# Altium schematic sheet TinyShuffle v.0b.SchDoc
size A2
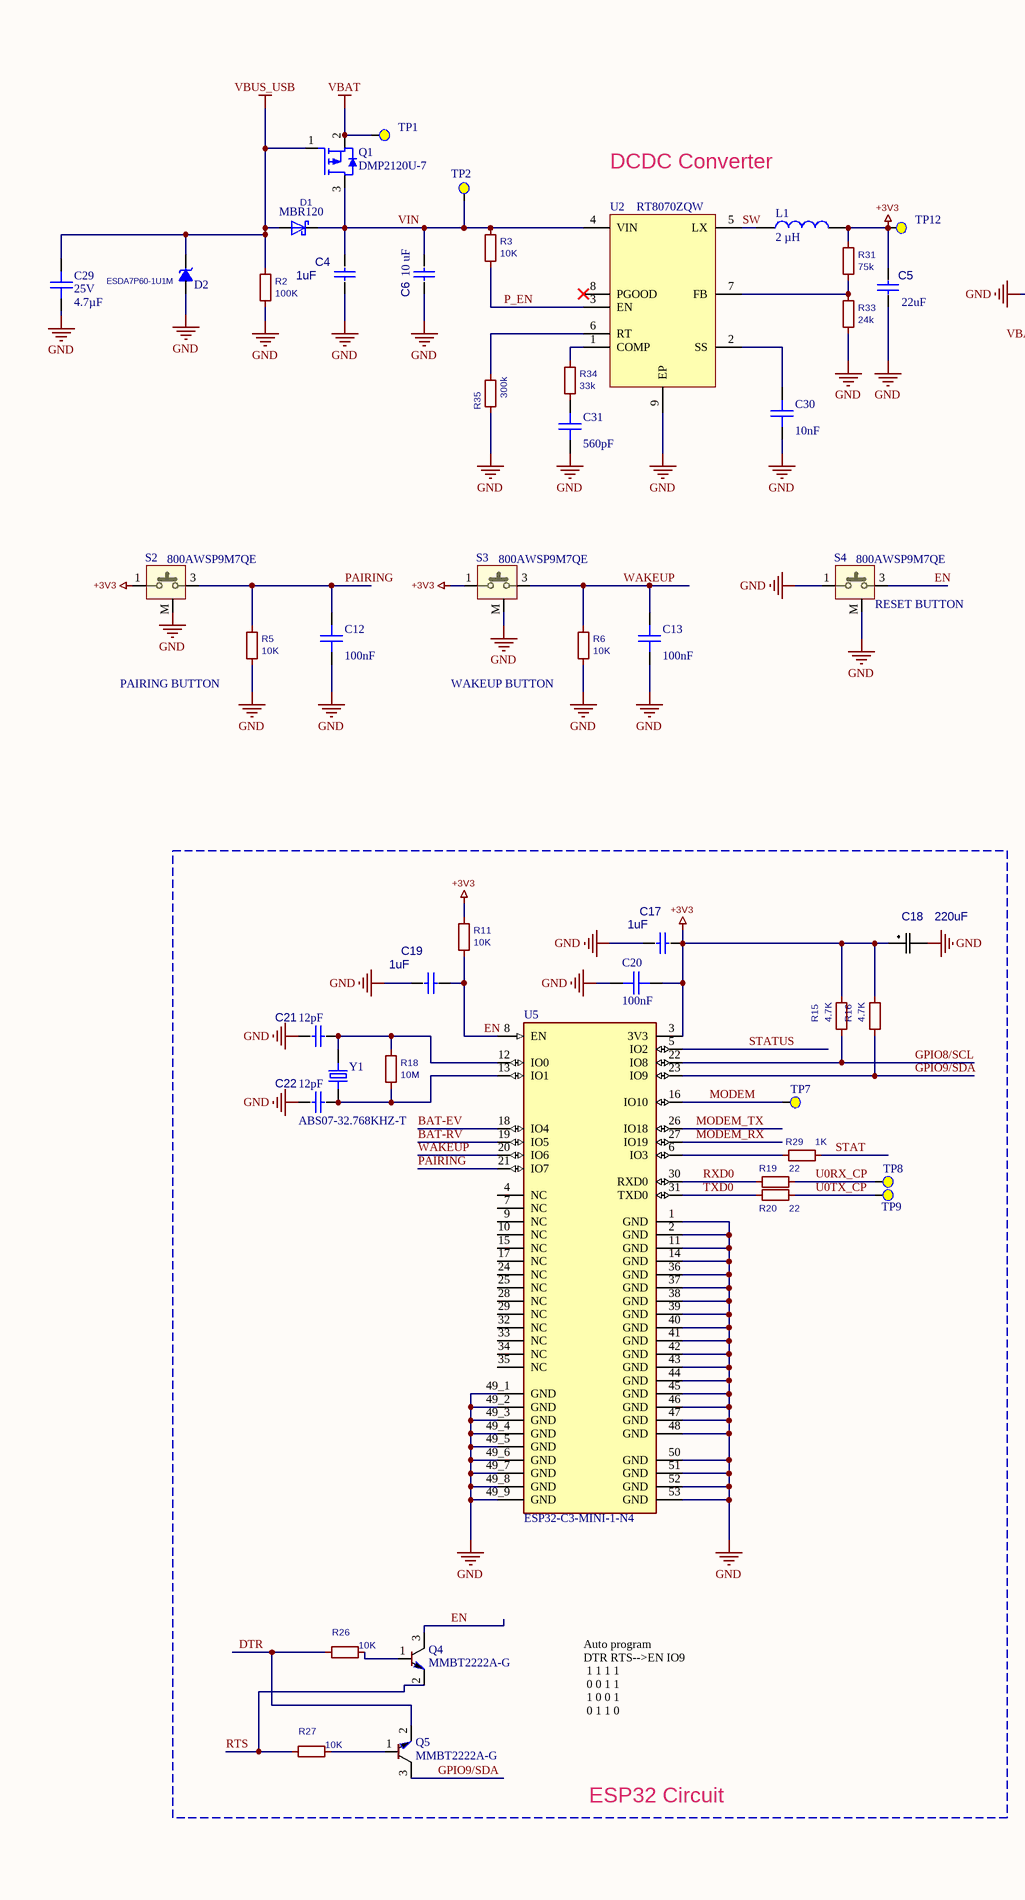
[diagram p0: TinyShuffle v.0b.SchDoc, left]
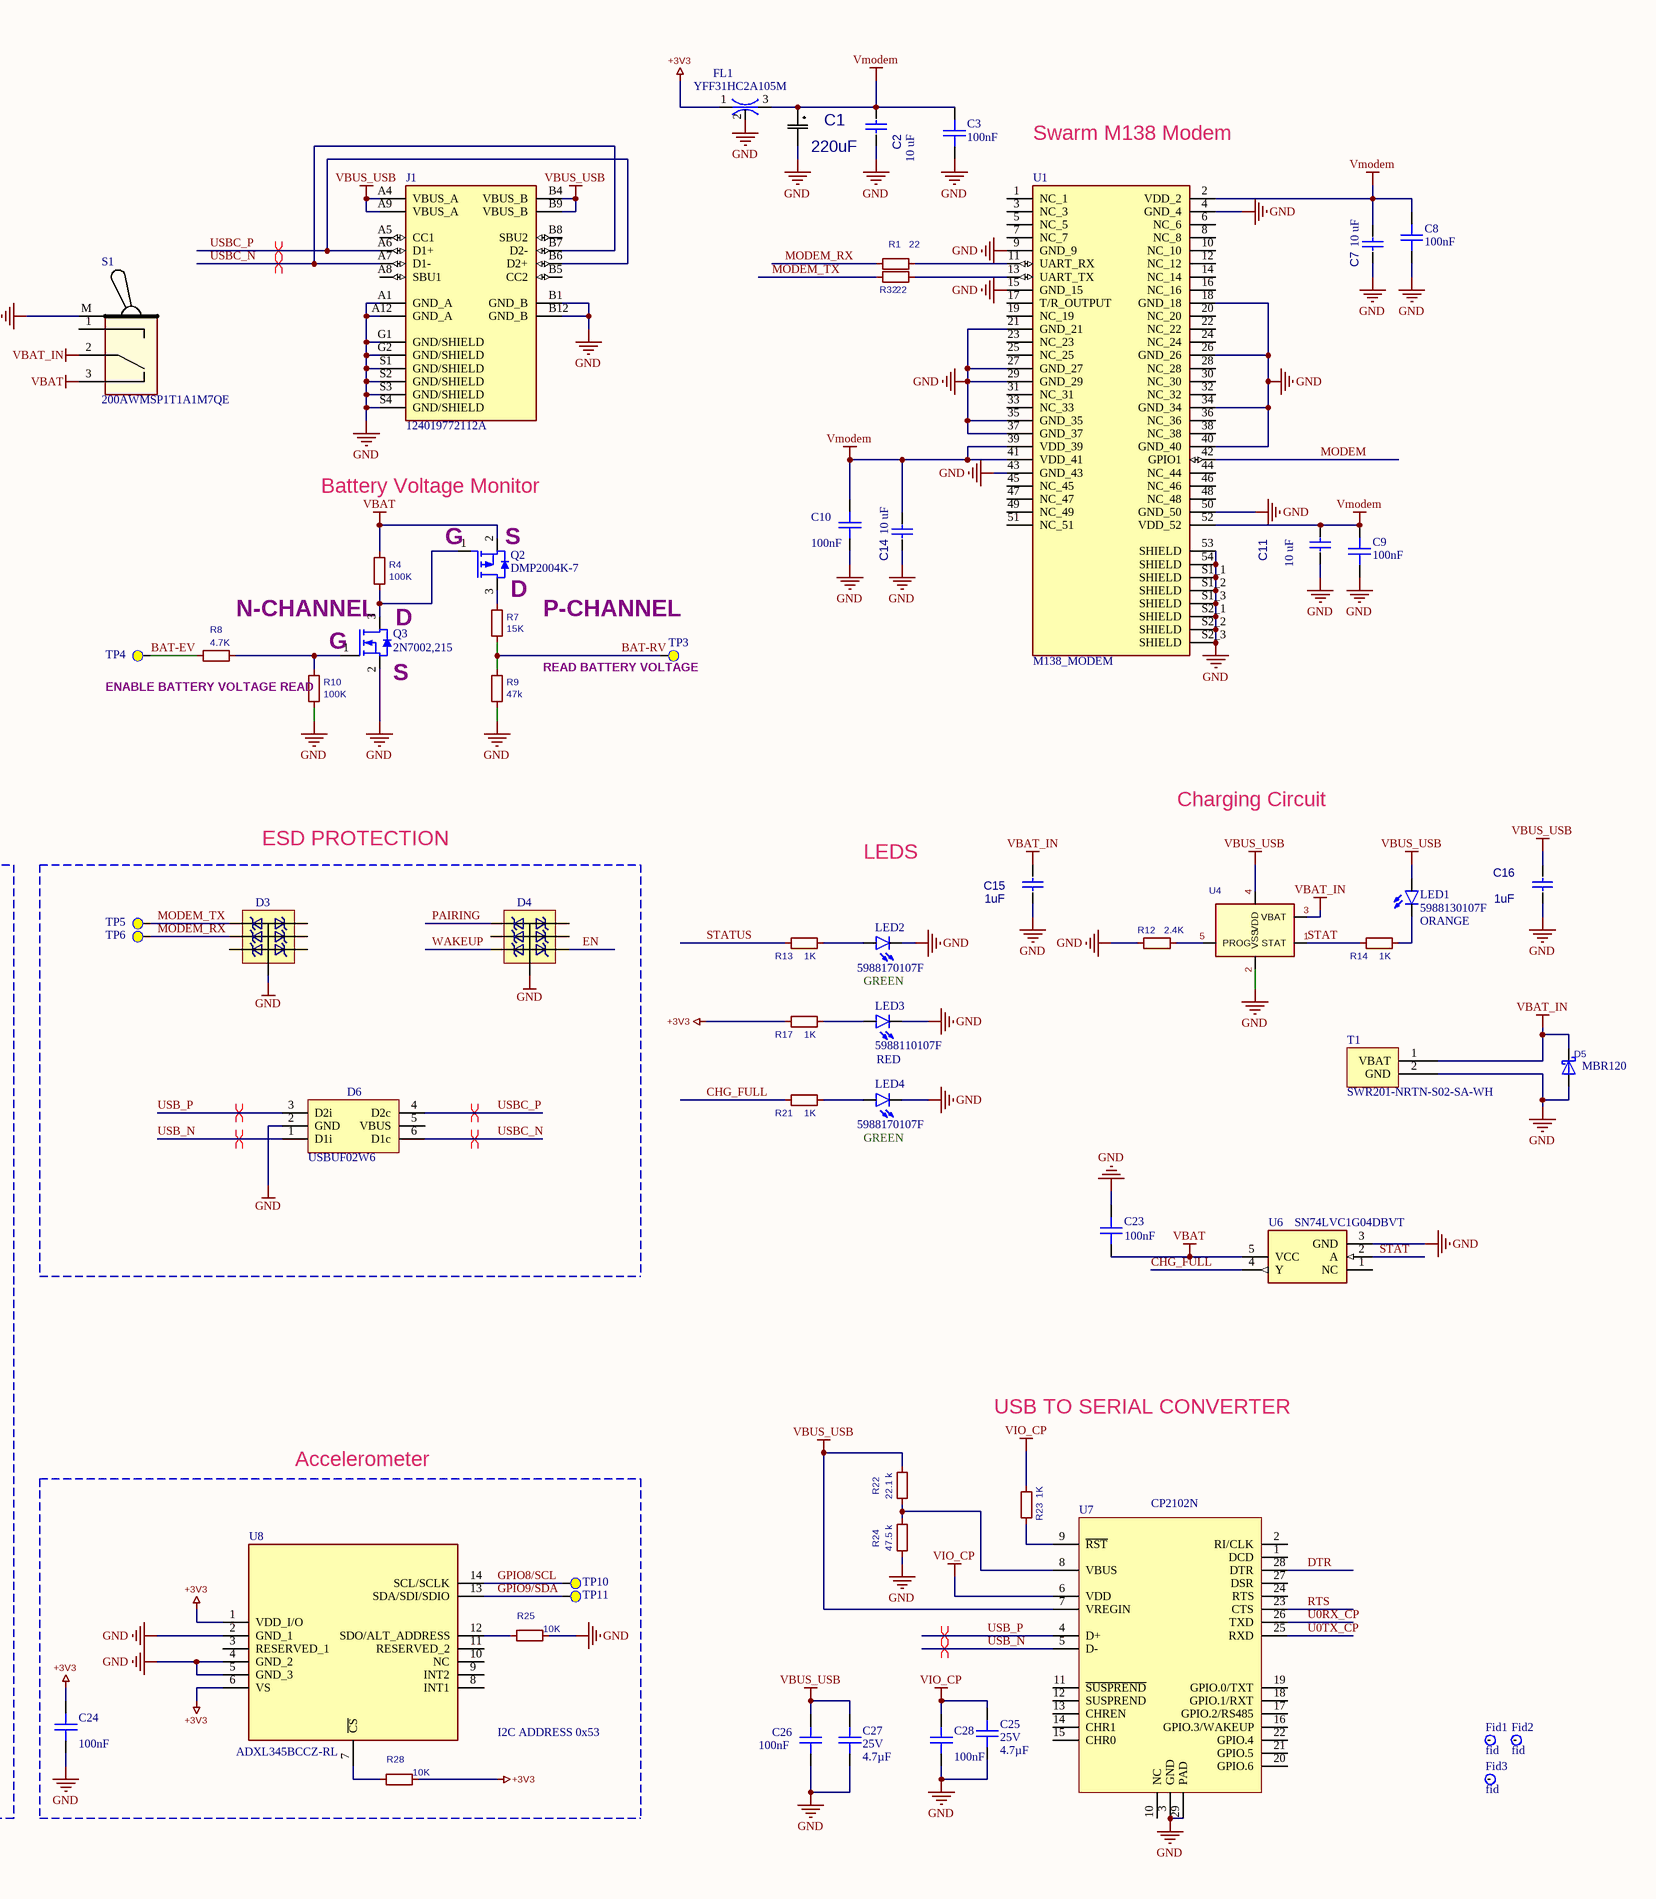
[diagram p1: TinyShuffle v.0b.SchDoc, right]

## Parts
C1  value 220uF  [CHEMI-H70]  (hidden comment: APXA6R3ARA221MH7)
C2  value 10 uF  [0603 Capacitor]  (hidden comment: CL10A106MA8NRNC)
C3  Capacitance: 100nF  [CAPC160X80X90L35L]  (hidden comment: CL10B104KB8NNWC)
C4  value 1uF  [0603 Capacitor]  (hidden comment: CC0603KRX7R8BB105)
C5  value 22uF  [CAPC2012X135N]  (hidden comment: CL21A226MOQNNNE)
C6  value 10 uF  [0603 Capacitor]  (hidden comment: CL10A106MA8NRNC)
C7  value 10 uF  [0603 Capacitor]  (hidden comment: CL10A106MA8NRNC)
C8  Capacitance: 100nF  [CAPC160X80X90L35L]  (hidden comment: CL10B104KB8NNWC)
C9  Capacitance: 100nF  [CAPC160X80X90L35L]  (hidden comment: CL10B104KB8NNWC)
C10  Capacitance: 100nF  [CAPC160X80X90L35L]  (hidden comment: CL10B104KB8NNWC)
C11  value 10 uF  [0603 Capacitor]  (hidden comment: CL10A106MA8NRNC)
C12  Capacitance: 100nF  [CAPC160X80X90L35L]  (hidden comment: CL10B104KB8NNWC)
C13  Capacitance: 100nF  [CAPC160X80X90L35L]  (hidden comment: CL10B104KB8NNWC)
C14  value 10 uF  [0603 Capacitor]  (hidden comment: CL10A106MA8NRNC)
C15  value 1uF  [0603 Capacitor]  (hidden comment: CC0603KRX7R8BB105)
C16  value 1uF  [0603 Capacitor]  (hidden comment: CC0603KRX7R8BB105)
C17  value 1uF  [0603 Capacitor]  (hidden comment: CC0603KRX7R8BB105)
C18  value 220uF  [CHEMI-H70]  (hidden comment: APXA6R3ARA221MH7)
C19  value 1uF  [0603 Capacitor]  (hidden comment: CC0603KRX7R8BB105)
C20  Capacitance: 100nF  [CAPC160X80X90L35L]  (hidden comment: CL10B104KB8NNWC)
C21  value 12pF  [0603 Capacitor]  (hidden comment: GRM1885C2A120JA01D)
C22  value 12pF  [0603 Capacitor]  (hidden comment: GRM1885C2A120JA01D)
C23  Capacitance: 100nF  [CAPC160X80X90L35L]  (hidden comment: CL10B104KB8NNWC)
C24  Capacitance: 100nF  [CAPC160X80X90L35L]  (hidden comment: CL10B104KB8NNWC)
C25  Voltage Rating: 25V  Capacitance: 4.7µF  [CAPC160X80X90L35L]  (hidden comment: GRM188R61E475KE11D)
C26  Capacitance: 100nF  [CAPC160X80X90L35L]  (hidden comment: CL10B104KB8NNWC)
C27  Voltage Rating: 25V  Capacitance: 4.7µF  [CAPC160X80X90L35L]  (hidden comment: GRM188R61E475KE11D)
C28  Capacitance: 100nF  [CAPC160X80X90L35L]  (hidden comment: CL10B104KB8NNWC)
C29  Voltage Rating: 25V  Capacitance: 4.7µF  [CAPC160X80X90L35L]  (hidden comment: GRM188R61E475KE11D)
C30  Capacitance: 10nF  [CAPC160X80X90L35L]  (hidden comment: CL10B103KB8NNNC)
C31  Capacitance: 560pF  [CAPC160X80X90L35L]  (hidden comment: CL10C561JB8NFNC)
D1  MBR120  [SODFL3616X98N]
D2  ESDA7P60-1U1M  [ST_1610]
D3  UCLAMP3306P.TCT  [SLP1616P6]  (value not drawn)
D4  UCLAMP3306P.TCT  [SLP1616P6]  (value not drawn)
D5  MBR120  [SODFL3616X98N]
D6  USBUF02W6  [SOT323-6L]
Fid1  fid  [Fiducial mark 1]  (no BOM)
Fid2  fid  [Fiducial mark 1]  (no BOM)
Fid3  fid  [Fiducial mark 1]  (no BOM)
FL1  YFF31HC2A105M  [FIL_YFF31HC2A105M]
J1  124019772112A  [AMPHENOL_124019772112A]
L1  2 µH  [INDC8080X42L]
LED1  5988130107F  value ORANGE  [LEDC2012X70N]
LED2  5988170107F  value GREEN  [LEDC2012X70N]
LED3  5988110107F  value RED  [LEDC2012X70N]
LED4  5988170107F  value GREEN  [LEDC2012X70N]
Q1  DMP2120U-7  [SOT23-3P95_237X112L50X40L]
Q2  DMP2004K-7  [SOT23-3P95_237X112L50X40L]
Q3  2N7002,215  [SOT23-3P95_237X112L50X40L]
Q4  MMBT2222A-G  [SOT96P237X111-3N]
Q5  MMBT2222A-G  [SOT96P237X111-3N]
R1  22  [RES0603]
R2  100K  [RES0603]
R3  10k  [RES0603]
R4  100K  [RES0603]
R5  10k  [RES0603]
R6  10k  [RES0603]
R7  15K  [RES0603]
R8  4.7K  [RES0603]
R9  47K  [RES0603]
R10  100K  [RES0603]
R11  10k  [RES0603]
R12  2.4K  [RES0603]
R13  1K  [RES0603]
R14  1K  [RES0603]
R15  4.7K  [RES0603]
R16  4.7K  [RES0603]
R17  1K  [RES0603]
R18  10M  [RES0603]
R19  22  [RES0603]
R20  22  [RES0603]
R21  1K  [RES0603]
R22  22.1 k  [RES0603]
R23  1K  [RES0603]
R24  47.5 k  [RES0603]
R25  10k  [RES0603]
R26  10k  [RES0603]
R27  10k  [RES0603]
R28  10k  [RES0603]
R29  1K  [RES0603]
R31  75K  [RES0603]
R32  22  [RES0603]
R33  24K  [RES0603]
R34  33K  [RES0603]
R35  300k  [RES0603]
S1  200AWMSP1T1A1M7QE  [200AWMSP1T1A1M7QE]
S2  800AWSP9M7QE  [800AWSP9M7QE]
S3  800AWSP9M7QE  [800AWSP9M7QE]
S4  800AWSP9M7QE  [800AWSP9M7QE]
T1  SWR201-NRTN-S02-SA-WH  [JST_B2B-PH-K-S(LF)(SN)]
TP1  TPAD  [PAD_2.0R]  (value not drawn)  (no BOM)
TP2  TPAD  [PAD_2.0R]  (value not drawn)  (no BOM)
TP3  TPAD  [PAD_2.0R]  (value not drawn)  (no BOM)
TP4  TPAD  [PAD_2.0R]  (value not drawn)  (no BOM)
TP5  TPAD  [PAD_2.0R]  (value not drawn)  (no BOM)
TP6  TPAD  [PAD_2.0R]  (value not drawn)  (no BOM)
TP7  TPAD  [PAD_2.0R]  (value not drawn)  (no BOM)
TP8  TPAD  [PAD_2.0R]  (value not drawn)  (no BOM)
TP9  TPAD  [PAD_2.0R]  (value not drawn)  (no BOM)
TP10  TPAD  [PAD_2.0R]  (value not drawn)  (no BOM)
TP11  TPAD  [PAD_2.0R]  (value not drawn)  (no BOM)
TP12  TPAD  [PAD_2.0R]  (value not drawn)  (no BOM)
U1  M138_MODEM  [XCVR_M138_MODEM]
U2  RT8070ZQW  [QFN65P300X300X80_HS-9L]
U4  MCP73831T-2ACI/OT  [SOT95P270X145-5N]  (value not drawn)
U5  ESP32-C3-MINI-1-N4  [XCVR_ESP32-C3-MINI-1-N4]
U6  SN74LVC1G04DBVT  [SOT95P270X145-5N]
U7  CP2102N  [QFN-28_1]
U8  ADXL345BCCZ-RL  [ADXL345BCCZRL]
Y1  ABS07-32.768KHZ-T  [XTAL_ABS07-32.768KHZ-T]

## Blocks framed on the sheet
ESP32 Circuit: C17-C22 Q4 Q5 R11 R15 R16 R18-R20 R26 R27 R29 TP7-TP9 U5 Y1
ESD PROTECTION: D3 D4 D6 TP5 TP6
Accelerometer: C24 R25 R28 TP10 TP11 U8

## Nets
+3V3: C5.2 C17.2 C18.1 C20.1 C24.2 FL1.1(IN/OUT) L1.2 R11.1 R15.2 R16.2 R17.2 R28.2 R31.1 S2.1 S3.1 TP12.1(TPoint) U5.3(3V3) U8.1(VDD_I/O) U8.6(VS)
GND: C1.2 C2.1 C3.1 C4.1 C5.1 C6.1 C7.1 C8.2 C9.1 C10.2 C11.1 C12.1 C13.1 C14.1 C15.1 C16.1 C17.1 C18.2 C19.2 C20.2 C21.2 C22.2 C23.2 C24.1 C25.1 C26.1 C27.1 C28.1 C29.1 C30.1 C31.1 D2.2(A) D3.7(Anode) D4.7(Anode) D5.2(A) D6.2(GND) FL1.2 J1.A1(GND_A) J1.A12(GND_A) J1.B1(GND_B) J1.B12(GND_B) J1.G1(GND/SHIELD) J1.G2(GND/SHIELD) J1.S1(GND/SHIELD) J1.S2(GND/SHIELD) J1.S3(GND/SHIELD) J1.S4(GND/SHIELD) LED2.C LED3.C LED4.C Q3.2 R2.2 R5.2 R6.2 R9.2 R10.2 R12.2 R24.2 R25.2 R33.2 R35.2 S1.M S2.M S3.M S4.1 S4.M T1.2(GND) U1.4(GND_4) U1.9(GND_9) U1.15(GND_15) U1.18(GND_18) U1.21(GND_21) U1.26(GND_26) U1.27(GND_27) U1.29(GND_29) U1.34(GND_34) U1.35(GND_35) U1.37(GND_37) U1.40(GND_40) U1.43(GND_43) U1.50(GND_50) U1.53(SHIELD) U1.54(SHIELD) U1.S1_1(SHIELD) U1.S1_2(SHIELD) U1.S1_3(SHIELD) U1.S2_1(SHIELD) U1.S2_2(SHIELD) U1.S2_3(SHIELD) U2.9(EP) U4.2(VSS) U5.1(GND) U5.2(GND) U5.11(GND) U5.14(GND) U5.36(GND) U5.37(GND) U5.38(GND) U5.39(GND) U5.40(GND) U5.41(GND) U5.42(GND) U5.43(GND) U5.44(GND) U5.45(GND) U5.46(GND) U5.47(GND) U5.48(GND) U5.49_1(GND) U5.49_2(GND) U5.49_3(GND) U5.49_4(GND) U5.49_5(GND) U5.49_6(GND) U5.49_7(GND) U5.49_8(GND) U5.49_9(GND) U5.50(GND) U5.51(GND) U5.52(GND) U5.53(GND) U6.3(GND) U7.3(GND) U7.29(PAD) U8.2(GND_1) U8.4(GND_2) U8.5(GND_3)
VBAT: C23.1 Q1.2 Q2.2 R4.1 S1.3 TP1.1(TPoint) U6.5(VCC)
VBAT_IN: C15.2 D5.1(K) S1.2 T1.1(VBAT) U4.3(VBAT)
VBUS_USB: C16.2 C26.2 C27.2 C29.2 D1.2(A) D2.1(K) J1.A4(VBUS_A) J1.A9(VBUS_A) J1.B4(VBUS_B) J1.B9(VBUS_B) LED1.A Q1.1 R2.1 R22.1 U4.4(VDD) U7.7(VREGIN)
VIO_CP: C25.2 C28.2 R23.1 U7.6(VDD)
Vmodem: C1.1 C2.2 C3.2 C7.2 C8.1 C9.2 C10.1 C11.2 C14.2 FL1.3(OUT/IN) U1.2(VDD_2) U1.39(VDD_39) U1.41(VDD_41) U1.52(VDD_52)
BAT-EV: R8.1 TP4.1(TPoint) U5.18(IO4)
BAT-RV: R7.2 R9.1 TP3.1(TPoint) U5.19(IO5)
CHG_FULL: R21.2 U6.4(Y)
DTR: Q5.2(E) R26.1 U7.28(DTR)
EN: C19.1 D4.4(C4) Q4.3(C) R11.2 S4.3 U5.8(EN)
GPIO8/SCL: R15.1 TP10.1(TPoint) U5.22(IO8) U8.14(SCL/SCLK)
GPIO9/SDA: Q5.3(C) R16.1 TP11.1(TPoint) U5.23(IO9) U8.13(SDA/SDI/SDIO)
MODEM: TP7.1(TPoint) U1.42(GPIO1) U5.16(IO10)
MODEM_RX: D3.2(C2) R1.2 TP6.1(TPoint) U5.27(IO19)
MODEM_TX: D3.1(C1) R32.2 TP5.1(TPoint) U5.26(IO18)
P_EN: R3.2 U2.3(EN)
PAIRING: C12.2 D4.1(C1) R5.1 S2.3 U5.21(IO7)
RTS: Q4.2(E) R27.1 U7.23(CTS)
RXD0: R19.2 U5.30(RXD0)
STAT: R14.2 R29.1 U4.1(STAT) U6.2(A)
STATUS: R13.2 U5.5(IO2)
SW: L1.1 U2.5(LX)
TXD0: R20.2 U5.31(TXD0)
U0RX_CP: R19.1 TP8.1(TPoint) U7.26(TXD)
U0TX_CP: R20.1 TP9.1(TPoint) U7.25(RXD)
USB_N: D6.1(D1i) U7.5(D-)
USB_P: D6.3(D2i) U7.4(D+)
USBC_N: D6.6(D1c) J1.A7(D1-) J1.B7(D2-)
USBC_P: D6.4(D2c) J1.A6(D1+) J1.B6(D2+)
VIN: C4.2 C6.2 D1.1(K) Q1.3 R3.1 TP2.1(TPoint) U2.4(VIN)
WAKEUP: C13.2 D4.3(C3) R6.1 S3.3 U5.20(IO6)
NetC21_1: C21.1 R18.1 U5.12(IO0) Y1.2
NetC22_1: C22.1 R18.2 U5.13(IO1) Y1.1
NetC30_2: C30.2 U2.2(SS)
NetC31_2: C31.2 R34.2
NetLED1_C: LED1.C R14.1
NetLED2_A: LED2.A R13.1
NetLED3_A: LED3.A R17.1
NetLED4_A: LED4.A R21.1
NetQ2_1: Q2.1 Q3.3 R4.2
NetQ2_3: Q2.3 R7.1
NetQ3_1: Q3.1 R8.2 R10.1
NetQ4_1: Q4.1(B) R26.2
NetQ5_1: Q5.1(B) R27.2
NetR1_1: R1.1 U1.11(UART_RX)
NetR12_1: R12.1 U4.5(PROG)
NetR22_2: R22.2 R24.1 U7.8(VBUS)
NetR23_2: R23.2 U7.9(~{RST})
NetR25_1: R25.1 U8.12(SDO/ALT_ADDRESS)
NetR28_1: R28.1 U8.7(~{CS})
NetR29_2: R29.2 U5.6(IO3)
NetR31_2: R31.2 R33.1 U2.7(FB)
NetR32_1: R32.1 U1.13(UART_TX)
NetR34_1: R34.1 U2.1(COMP)
NetR35_1: R35.1 U2.6(RT)

Not connected (* = marked no-connect by the designer): D3 3(C3) 4(C4) 5(C5) 6(C6); D4 2(C2) 5(C5) 6(C6); D6 5(VBUS); Fid1 0; Fid2 0; Fid3 0; J1 A5(CC1) A8(SBU1) B5(CC2) B8(SBU2); S1 1; U1 1(NC_1) 3(NC_3) 5(NC_5) 6(NC_6) 7(NC_7) 8(NC_8) 10(NC_10) 12(NC_12) 14(NC_14) 16(NC_16) 17(T/R_OUTPUT) 19(NC_19) 20(NC_20) 22(NC_22) 23(NC_23) 24(NC_24) 25(NC_25) 28(NC_28) 30(NC_30) 31(NC_31) 32(NC_32) 33(NC_33) 36(NC_36) 38(NC_38) 44(NC_44) 45(NC_45) 46(NC_46) 47(NC_47) 48(NC_48) 49(NC_49) 51(NC_51); U2 8(PGOOD)*; U5 4(NC) 7(NC) 9(NC) 10(NC) 15(NC) 17(NC) 24(NC) 25(NC) 28(NC) 29(NC) 32(NC) 33(NC) 34(NC) 35(NC); U6 1(NC); U7 1(DCD) 2(RI/CLK) 10(NC) 11(~{SUSPREND}) 12(SUSPREND) 13(CHREN) 14(CHR1) 15(CHR0) 16(GPIO.3/WAKEUP) 17(GPIO.2/RS485) 18(GPIO.1/RXT) 19(GPIO.0/TXT) 20(GPIO.6) 21(GPIO.5) 22(GPIO.4) 24(RTS) 27(DSR); U8 3(RESERVED_1) 8(INT1) 9(INT2) 10(NC) 11(RESERVED_2)

## Layout directives
differential pair; differential pair class USB: USB_N, USB_P, USBC_N, USBC_P

## Notes on the sheet
- Swarm M138 Modem
- DCDC Converter
- Battery Voltage Monitor
- (near Q2) G
- (near Q2) S
- D
- (near S4) RESET BUTTON
- (near Q3) N-CHANNEL
- G
- P-CHANNEL
- PAIRING BUTTON
- WAKEUP BUTTON
- ENABLE BATTERY VOLTAGE READ
- (near Q3) S
- (near TP3) READ BATTERY VOLTAGE
- LEDS
- Charging Circuit
- USB TO SERIAL CONVERTER
- Auto program
  DTR RTS-->EN IO9
  1 1 1 1
  0 0 1 1
  1 0 0 1
  0 1 1 0
- (near U8) I2C ADDRESS 0x53
- Title
- Size:
- A3
- Number:
- Revision:
- Date:
- Time:
- Sheet
- of

## Library data of the parts
C1 C18 = APXA6R3ARA221MH7: CAP ALUM POLY 220UF 20% 6.3V SMD; Manufacturer: Nippon Chemi-Con; ManufacturerPartNumber: APXA6R3ARA221MH70G; C: Copyright (C) 2015 Accelerated Designs. All rights reserved; Copyright: Copyright (C) 2022 Ultra Librarian. All rights reserved.; Digi-Key_Part_Number_1: 565-3114-1-ND; Digi-Key_Part_Number_2: 565-3114-2-ND; Digi-Key_Part_Number_3: 565-3114-2-NDL; Digi-Key_Part_Number_4: 565-3114-6-ND
C2 C6 C7 C11 C14 = CAPC1608N-0.1UF: 25V 10UF X5R ±20% 0603 MLCC; Manufacturer: Samsung Electro-Mechanics; ManufacturerPartNumber: CL10A106MA8NRNC; Mouser Part Number: 187-CL10A106MA8NRNC; Mouser Price/Stock: https://eu.mouser.com/ProductDetail/Samsung-Electro-Mechanics/CL10A106MA8NRNC?qs=47mY1nHWefS2vFRvRJVTdQ%3D%3D
C3 C8-C10 C12 C13 C20 C23 C24 C26 C28 = CMP-00119-2: CAP CER 0.1UF 50V X7R 0603; Manufacturer: Samsung Electro-Mechanics; Op Temp min: -55°C; Tolerance: 10%; Op Temp max: 125°C; Voltage Rating: 50V; ComponentLink3URL: https://www.digikey.com/en/products/detail/samsung-electro-mechanics/CL10B104KB8NNWC/3887593; Dielectric: X7R; Ratings: -; Size: 1.60mm x 0.80mm; ComponentLink1Description: Datasheet; ComponentLink2Description: Mouser; ComponentLink3Description: Digikey; ComponentLink1URL: http://product.samsungsem.com/mlcc/CL10B104KB8NNW.do; ComponentLink2URL: https://eu.mouser.com/ProductDetail/Samsung-Electro-Mechanics/CL10B104KB8NNWC?qs=%2Fha2pyFaduh3vwrZSGoh3Z6Gj3oVa1Y%2Fpd7iGPjF01jpt%2F6TY3kdMw%3D%3D; ManufacturerPartNumber: CL10B104KB8NNWC; Package: 0603 (1608 Metric); Mounting Type: SM; Height max: 900µm; Lead Spacing: 0mm
C4 C15-C17 C19 = CAPC1608N-0.1UF: CAP CER 1UF 25V X7R 0603; Manufacturer: YAGEO; ManufacturerPartNumber: CC0603KRX7R8BB105; Mouser Part Number: 603-CC603KRX7R8BB105; Mouser Price/Stock: https://eu.mouser.com/ProductDetail/YAGEO/CC0603KRX7R8BB105?qs=57cj7OiSijm1JqG%252BGXtOuQ%3D%3D
C5 = CL21A226MOQNNNE: CAP CER 22UF 16V X5R 0805; Manufacturer: Samsung Electro-Mechanics; Tolerance: ±20%; ManufacturerPartNumber: CL21A226MOQNNNE; Voltage - Rated: 16V; Temperature Coefficient: X5R; Operating Temperature: -55°C ~ 85°C; Package / Case: 0805 (2012 Metric); ComponentLink1Description: Datasheet; ComponentLink1URL: https://media.digikey.com/pdf/Data%20Sheets/Samsung%20PDFs/CL21A226MOQNNNE_Spec.pdf; ComponentLink2Description: Digikey; ComponentLink2URL: https://www.digikey.com/en/products/detail/samsung-electro-mechanics/CL21A226MOQNNNE/3888567
C21 C22 = CAPC1608N-0.1UF: CAP CER 12PF NP0 0603; Manufacturer: Murata Electronics; ManufacturerPartNumber: GRM1885C2A120JA01D
C25 C27 C29 = CMP-001-0280-2: CAP CER 4.7UF 25V X5R 0603; Manufacturer: Murata Electronics; Tolerance: 10%; Op Temp max: 85°C; Op Temp min: -55°C; Lead Spacing: 0mm; ComponentLink1URL: https://www.murata.com/-/media/webrenewal/support/library/catalog/products/capacitor/ceramiccapacitor/c02e.ashx?la=en-us&cvid=20210120024548000000; ComponentLink2URL: https://eu.mouser.com/ProductDetail/Murata-Electronics/GRM188R61E475KE11D?qs=eeBpzGFlv%252B9M0HqzMo%2FgYw%3D%3D; ComponentLink2Description: Mouser; Size: 1.60mm x 0.80mm; Dielectric: X5R; Package: 0603 (1608 Metric); ComponentLink1Description: Datasheet; ComponentLink3URL: https://www.digikey.com/en/products/detail/murata-electronics/GRM188R61E475KE11D/3900465; Ratings: -; Mounting Type: SM; Height max: 800µm; ManufacturerPartNumber: GRM188R61E475KE11D; ComponentLink3Description: Digikey
C30 = CMP-00119-2: CAP CER 10000PF 50V X7R 0603; Manufacturer: Samsung Electro-Mechanics; Op Temp min: -55°C; Tolerance: 10%; Op Temp max: 125°C; Voltage Rating: 50V; ComponentLink3URL: https://www.digikey.com/en/products/detail/samsung-electro-mechanics/CL10B103KB8NNNC/3886667; Dielectric: X7R; Ratings: -; Size: 1.60mm x 0.80mm; ComponentLink1Description: Datasheet; ComponentLink2Description: Mouser; ComponentLink3Description: Digikey; ComponentLink1URL: https://media.digikey.com/pdf/Data%20Sheets/Samsung%20PDFs/CL10B103KB8NNNC_Spec.pdf; ComponentLink2URL: https://www.mouser.com/ProductDetail/Samsung-Electro-Mechanics/CL10B103KB8NNNC?qs=349EhDEZ59pAsZxZjVI0UQ%3D%3D; ManufacturerPartNumber: CL10B103KB8NNNC; Package: 0603 (1608 Metric); Mounting Type: SM; Height max: 900µm; Lead Spacing: 0mm
C31 = CMP-00119-2: CAP CER 560PF 50V C0G/NP0 0603; Manufacturer: Samsung Electro-Mechanics; Op Temp min: -55°C; Dielectric: C0G, NP0; Tolerance: 10%; Op Temp max: 125°C; Voltage Rating: 50V; ComponentLink3URL: https://www.digikey.com/en/products/detail/samsung-electro-mechanics/CL10C561JB8NFNC/3887973; Ratings: -; Size: 1.60mm x 0.80mm; ComponentLink1Description: Datasheet; ComponentLink2Description: Mouser; ComponentLink3Description: Digikey; ComponentLink1URL: https://www.samsungsem.com/kr/support/product-search/mlcc/CL10C561JB8NFNC.jsp; ComponentLink2URL: https://www.mouser.com/ProductDetail/Samsung-Electro-Mechanics/CL10C561JB8NFNC?qs=h6Piwd%2Fnvzm6ky5tL0eH4g%3D%3D; ManufacturerPartNumber: CL10C561JB8NFNC; Package: 0603 (1608 Metric); Mounting Type: SM; Height max: 900µm; Lead Spacing: 0mm
D1 D5 = MBR0520: 20V 600mV@1A 1A SOD-123 Schottky Barrier Diodes (SBD) ROHS; ManufacturerPartNumber: LMBR120FT1G; Generic Part: no; Manufacturer: ON; Footprint: Diode_SMD:D_SOD-123; LCSC Part Number: C81143
D2 = ESDA7P60-1U1M: TVS DIODE 5V 11.6V 1610; Manufacturer: STMicroelectronics; Group: Diode; ManufacturerPartNumber: ESDA7P60-1U1M; MPN: ESDA7P60-1U1M; Supplier 1: Digi-Key; Supplier 1 Link: https://www.digikey.com/en/products/detail/stmicroelectronics/ESDA7P60-1U1M/5768408?s=N4IgTCBcDaIKIGUAiBBA7ABQGwAYC0AjAKoECyIAugL5A; Supplier 1 Part Number: 497-16253-2-ND; Value: ESDA7P60-1U1M; Price: 0.07875; Package/Case: 1610
D3 D4 = UCLAMP3306P.TCT: TVS DIODE 3.3V 8V SLP1616P6; Manufacturer: Semtech; ManufacturerPartNumber: UCLAMP3306P.TCT; Group: Diode; Value: UCLAMP3306P.TCT; Supplier 1 Link: https://www.mouser.co.uk/ProductDetail/Semtech/UCLAMP3306PTCT?qs=sGAEpiMZZMvxHShE6Whpu05L4sgaWrd7w3EbVo7phXk%3D; Supplier 1 Part Number: 947-UCLAMP3306P.TCT; Supplier 1: Mouser; Price: 0.337; Package/Case: 6-UFDFN Exposed Pad
D6 = NUF2221W1T2G: FILTER RC(PI) 22 OHM/47PF SMD; Manufacturer: STMicroelectronics; Group: Diode; ManufacturerPartNumber: USBUF02W6; Value: USBUF02W6; Supplier 1 Link: https://www.digikey.com/en/products/detail/stmicroelectronics/USBUF02W6/686422; Supplier 1 Part Number: 497-3743-2-ND; Supplier 1: Digi-Key; Price: 0.8; Package/Case: SOT363
FL1 = YFF31HC2A105M: 1ÂµF Feed Through Capacitor 100V 6A 5mOhm 1206 (3216 Metric), 4 PC Pad; Manufacturer: TDK; ManufacturerPartNumber: YFF31HC2A105M; Package: 0402 TDK; SnapEDA_Link: https://www.snapeda.com/parts/YFF31HC2A105M/TDK/view-part/566442/?ref=snap; Value: *; Check_prices: https://www.snapeda.com/parts/YFF31HC2A105M/TDK/view-part/566442/?ref=eda; Purchase-URL: https://pricing.snapeda.com/search/part/YFF31HC2A105M/?ref=eda; Digi-Key_Part_Number: 445-16151-1-ND
J1 = 124019772112A: USB2.0, TOP MOUNT, R/A, 16 PIN, DUAL; Manufacturer: Amphenol Commercial Products; Value: *; Availability: Bad; Check_prices: https://www.snapeda.com/parts/124019772112A/Amphenol/view-part/4792123/?ref=eda; SnapEDA_Link: https://www.snapeda.com/parts/124019772112A/Amphenol/view-part/4792123/?ref=snap; Package: None; ManufacturerPartNumber: 124019772112A; Price: None
L1 = NR8040T2R0N: FIXED IND 2UH 6.3A 11.7 MOHM SMD; Manufacturer: Taiyo Yuden; Material: Drum Core, Wirewound; ComponentLink1Description: Digikey; ComponentLink1URL: https://www.digikey.com/en/products/detail/taiyo-yuden/NR8040T2R0N/1739079; ComponentLink2Description: Datasheet; ComponentLink2URL: https://www.yuden.co.jp/productdata/catalog/wound04_e.pdf; Mounting Technology: SMT; Operating Temperature: -50 to +100degC; Packaging: Tape and Reel; DC Resistance max.: 11.7mOhm; ManufacturerPartNumber: NR8040T2R0N; Rated Current: 6.3 A; Inductance: 2 µH; Height: 4.0mm; Length: 8.0mm; Width: 8.0mm
LED1 = 598_SERIES_LED: Orange 605nm LED Indication - Discrete 2V 0805 (2012 Metric); ManufacturerPartNumber: 598-8110-107F; Manufacturer: Dialight; SnapEDA_Link: https://www.snapeda.com/parts/598-8110-107F/Dialight/view-part/275124/?ref=snap; Price: None; Package: 0805 Dialight; Availability: Unavailable
LED2 LED4 = 598_SERIES_LED: Green 566nm LED Indication - Discrete 2V 0805 (2012 Metric); ManufacturerPartNumber: 598-8110-107F; Manufacturer: Dialight; SnapEDA_Link: https://www.snapeda.com/parts/598-8110-107F/Dialight/view-part/275124/?ref=snap; Price: None; Package: 0805 Dialight; Availability: Unavailable
LED3 = 598_SERIES_LED: Red 635nm LED Indication - Discrete 2.2V 0805 _2012 Metric_; ManufacturerPartNumber: 598-8110-107F; Manufacturer: Dialight; SnapEDA_Link: https://www.snapeda.com/parts/598-8110-107F/Dialight/view-part/275124/?ref=snap; Price: None; Package: 0805 Dialight; Availability: Unavailable
Q1 = CMP-001-0218-5: MOSFET P-CH 20V 3.8A SOT23; Manufacturer: Diodes Incorporated; Vgs: 2V @ 250µA; Vgs (MAX): ±8V; Rds @ Id, Vgs: 62mOhm @ 4.2A, 4.5V; Op Temp min: -55°C; FET Type: P-Channel; Pmax: 800mW (Ta); Input Capacitance (Ciss) (Max) @ Vds: 487pF @20V; Current - Continuous Drain (Id) @ 25°C: 3.8A (Ta); Op Temp max: 150°C; Package: SOT-23-3; ComponentLink3URL: https://www.digikey.com/en/products/detail/diodes-incorporated/DMP2120U-7/8275357; ComponentLink1Description: Datasheet; Mounting Type: SM; Technology: MOSFET; Height max: 1.12mm; ManufacturerPartNumber: DMP2120U-7; Drain to Source Voltage (Vdss): 20 V; ComponentLink3Description: Digikey; ComponentLink2URL: https://eu.mouser.com/ProductDetail/Vishay-Semiconductors/SI2325DS-T1-E3?qs=jcx%252B0HVgj2ZrYzLJS1OITQ%3D%3D; Size: 2.9x2.3; ComponentLink2Description: Mouser; ComponentLink1URL: https://www.vishay.com/docs/73238/73238.pdf
Q2 = CMP-001-0218-5: MOSFET P-CH 20V 600MA SOT23-3; Manufacturer: Diodes Incorporated; Vgs: 1V @ 250µA; Vgs (MAX): ±8V; Rds @ Id, Vgs: 900mOhm @ 430mA, 4.5V; Op Temp min: -55°C; FET Type: P-Channel; Pmax: 225mW; Input Capacitance (Ciss) (Max) @ Vds: 175 pF @ 16 V; Op Temp max: 150°C; Package: SOT-23-3; ComponentLink3URL: https://www.digikey.com/en/products/detail/diodes-incorporated/DMP2004K-7/1774201; ComponentLink1Description: Datasheet; Mounting Type: SM; Technology: MOSFET; Height max: 1.12mm; ManufacturerPartNumber: DMP2004K-7; Drain to Source Voltage (Vdss): 20 V; ComponentLink3Description: Digikey; ComponentLink2URL: https://www.mouser.com/ProductDetail/Diodes-Incorporated/DMP2004K-7?qs=R%252By5Lqt1H6xpbz%252B9t5zMtA%3D%3D; Size: 2.9x2.3; ComponentLink2Description: Mouser; Current - Continuous Drain (Id) @ 25°C: 600mA; ComponentLink1URL: https://www.diodes.com/assets/Datasheets/ds30933.pdf
Q3 = CMP-001-0268-1: Power MOSFET, N Channel, 60 V, 300 mA, 2.8 ohm, SOT-23, Surface Mount; Manufacturer: Nexperia USA Inc.; Op Temp max: 150°C; Current - Continuous Drain (Id) @ 25°C: 360mA; Drain to Source Voltage (Vdss): 60V; FET Type: N-Channel; Input Capacitance (Ciss) (Max) @ Vds: 50 pF @ 10 V; Pmax: 350mW; Op Temp min: -55°C; Rds @ Id, Vgs: 1.6Ohm @ 500mA, 10V; Vgs (MAX): 20; Vgs: 2.4V; ComponentLink1URL: https://assets.nexperia.com/documents/data-sheet/2N7002P.pdf; Size: 2.9x2.3; ComponentLink1Description: Datasheet; ComponentLink2Description: Mouser; Mounting Type: SM; ComponentLink2URL: https://eu.mouser.com/ProductDetail/Nexperia/2N7002P235?qs=A1cBxND5mHJjAcok1kSTYw%3D%3D; Height max: 1.1mm; Package: SOT-23-3; ManufacturerPartNumber: 2N7002,215; Technology: MOSFET; ComponentLink3Description: Digikey; ComponentLink3URL: https://www.digikey.com/en/products/detail/nexperia-usa-inc/2N7002-215/762973
Q4 Q5 = MMBT2222ALT1G: Integrated Circuit; Manufacturer: Comchip Technology; Datasheet Link: https://www.comchiptech.com/admin/files/product/MMBT2222A-G%20RevB.pdf; Height: 1.11mm; ManufacturerPartNumber: MMBT2222A-G; Arrow Part Number: MMBT2222A-G; Arrow Price/Stock: https://www.arrow.com/en/products/mmbt2222alt1g/on-semiconductor; Mouser Part Number: 863-MMBT2222ALT1G; Mouser Price/Stock: https://www.mouser.co.uk/ProductDetail/ON-Semiconductor/MMBT2222ALT1G?qs=HVbQlW5zcXWwnD7Jokybqg%3D%3D; LCSC Part Number: C82460
R1 R19 R20 R32 = 1K_0603: RES 22OHM 1/10W 1% 0603 SMD; ManufacturerPartNumber: RC0603FR-0722RL; Generic Part: no; Manufacturer: Yageo; Value: 22; Footprint: Resistor_SMD:R_0603_1608Metric; LCSC Part Number: *
R2 R4 R10 = 100K_0603: Res General Purpose Thick Film 0603 100k Ohm 1% 1/10W ±100ppm/°C Molded; ManufacturerPartNumber: CRCW0603100KFKEAHP; Generic Part: no; Manufacturer: Vishay; Value: 100K; Footprint: Resistor_SMD:R_0603_1608Metric
R3 R5 R6 R11 R25-R28 = 100K_0603: RES 10.0K OHM 1/10W 1% 0603 SMD Ro HS; ManufacturerPartNumber: RGA1608P-103-B-T1; Generic Part: no; Manufacturer: Susumu; Value: 10K; Footprint: Resistor_SMD:R_0603_1608Metric; Mouser Part Number: 754-RGA1608P-103BT1; ComponentLink1Description: Datasheet Link; ComponentLink1URL: https://componentsearchengine.com/Datasheets/1/RGA1608P-103-B-T1.pdf
R7 = 330K_0603: RES 15K OHM 1% 1/10W 0603; ManufacturerPartNumber: CRCW060315K0FKEAC; Generic Part: no; Manufacturer: Vishay; Value: 15K; Footprint: Resistor_SMD:R_0603_1608Metric
R8 R15 R16 = 100K_0603: Thin Film Resistors - SMD 1/10W 4.7K ohm 1% 50ppm; ManufacturerPartNumber: RT0603FRE074K7L; Manufacturer: YAGEO; Value: 4.7K; Footprint: Resistor_SMD:R_0603_1608Metric
R9 = 100K_0603: RES SMD 47K OHM 1% 1/10W 0603; ManufacturerPartNumber: CRCW060347K0FKTA; Generic Part: no; Manufacturer: Vishay; Value: 47k; Footprint: Resistor_SMD:R_0603_1608Metric
R12 = 10K_0603: 2.4 kOhms ±1% 0.1W, 1/10W Chip Resistor 0603 (1608 Metric) Thick Film; ManufacturerPartNumber: CRCW06032K40FKEAC; Generic Part: no; Manufacturer: Vishay; Value: 2.4K; Footprint: Resistor_SMD:R_0603_1608Metric; LCSC Part Number: *
R13 R14 R17 R21 R23 R29 = 1K_0603: RES 1.00K OHM 1/10W 1% 0603 SMD; ManufacturerPartNumber: CRCW06031K00FKEAHP; Generic Part: no; Manufacturer: Vishay; Value: 1K; Footprint: Resistor_SMD:R_0603_1608Metric; LCSC Part Number: *
R18 = 100K_0603: Res Thick Film 0603 10M Ohm 1% 1/10W ±200ppm/°C Molded SMD SMD Paper T/R; Generic Part: YES; ManufacturerPartNumber: CRCW060310M0JNEA; Manufacturer: Vishay Dale; Value: 10M; Footprint: Resistor_SMD:R_0603_1608Metric
R22 = 1K_0603: RES SMD 22.1K OHM 1% 1/10W 0603; ManufacturerPartNumber: CRCW060322K1FKEA; Manufacturer: Vishay; Value: 22.1 k; Footprint: Resistor_SMD:R_0603_1608Metric
R24 = 1K_0603: RES 47.5K OHM 1% 1/10W 0603; ManufacturerPartNumber: CRCW060347K5FKEAC; Manufacturer: Vishay; Value: 47.5 k; Footprint: Resistor_SMD:R_0603_1608Metric
R31 = 100K_0603: RES 75K OHM 1% 1/10W 0603; ManufacturerPartNumber: CRCW060375K0FKEAC; Generic Part: no; Manufacturer: Vishay Dale; Value: 75k; Footprint: Resistor_SMD:R_0603_1608Metric
R33 = 100K_0603: RES 24K OHM 1% 1/10W 0603; ManufacturerPartNumber: CRCW060324K0FKEAC; Generic Part: no; Manufacturer: Vishay Dale; Value: 24k; Footprint: Resistor_SMD:R_0603_1608Metric
R34 = 100K_0603: RES SMD 33K OHM 1% 1/10W 0603; ManufacturerPartNumber: RT0603DRE0733KL; Generic Part: no; Manufacturer: YAGEO; Value: 33k; Footprint: Resistor_SMD:R_0603_1608Metric
R35 = 1K_0603: RES 300K OHM 5% 1/10W 0603; ManufacturerPartNumber: RC0603JR-07300KL; Generic Part: no; Manufacturer: Yageo; Value: 300k; Footprint: Resistor_SMD:R_0603_1608Metric; LCSC Part Number: *
S1 = 200AWMSP1T1A1M7QE: SWITCH TOGGLE SPDT 3A 120V; Manufacturer: E-Switch; ManufacturerPartNumber: 200AWMSP1T1A1M7QE
S2-S4 = 800AWSP9M7QE: Pushbutton Switch SPST-NO Standard Through Hole, Right Angle, Vertical; Manufacturer: E-Switch; ManufacturerPartNumber: 800AWSP9M7QE
T1 = Battery Connector: Connector Header, PH Series, 2 Position, 2.00mm, Through Hole, Press-Fit, Solder, Natural; Manufacturer: Sullins Connector Solutions; ManufacturerPartNumber: SWR201-NRTN-S02-SA-WH
TP1-TP12 = TPAD: Test Pad, SMD; Group: Test point
U1 = M138_MODEM: 'SWARM M138 MODEM mPCIe 2.005" (50.925mm) x 1.18" (30mm)  Two part connector; Manufacturer: Swarm; ManufacturerPartNumber: A: MM60-52B1-B1-R850 B: MM60-EZH039-B5-R850
U2 = RT8070ZQW: IC REG BUCK ADJUSTABLE 4A 8WDFN; Manufacturer: Richtek USA Inc.; Voltage - Input (Min): 2.7V; Voltage - Input (Max): 5.5V; Voltage - Output (Min/Fixed): 0.8V; Voltage - Output (Max): 5V; Frequency - Switching: 200kHz ~ 2MHz; ComponentLink1Description: Datasheet; ComponentLink1URL: https://www.richtek.com/assets/product_file/RT8070/DS8070-09.pdf; ComponentLink2Description: Digikey; ComponentLink2URL: https://www.digikey.com/en/products/detail/richtek-usa-inc/RT8070ZQW/3078331; ManufacturerPartNumber: RT8070ZQW; Current - Output: 4A; Package / Case: 8-WDFN Exposed Pad
U4 = MCP73831-2-OT: IC BATT CNTL LI-ION 1CEL SOT23-5; Generic Part: no; Manufacturer: Microchip Technology; ManufacturerPartNumber: MCP73831T-2ACI/OT; Footprint: Package_TO_SOT_SMD:SOT-23-5; LCSC Part Number: *
U5 = ESP32-C3-MINI-1-N4: Bluetooth, WiFi 802.11b/g/n, Bluetooth v5.0 Transceiver Module 2.412GHz ~ 2.484GHz PCB Trace Surface Mount; Manufacturer: Espressif Systems; Purchase-URL: https://pricing.snapeda.com/search/part/ESP32-C3-MINI-1-N4/?ref=eda; Value: *; Package: SMD-53 Espressif Systems; Check_prices: https://www.snapeda.com/parts/ESP32-C3-MINI-1-N4/Espressif+Systems/view-part/?ref=eda; Price: None; Availability: In Stock; ManufacturerPartNumber: ESP32-C3-MINI-1-N4; SnapEDA_Link: https://www.snapeda.com/parts/ESP32-C3-MINI-1-N4/Espressif+Systems/view-part/?ref=snap
U6 = SN74LVC1G04DBVR: Inverter IC 1 Channel - SOT-23-5; Manufacturer: Texas Instruments; Datasheet Link: https://www.ti.com/general/docs/suppproductinfo.tsp?distId=10&gotoUrl=https%3A%2F%2Fwww.ti.com%2Flit%2Fgpn%2Fsn74lvc1g04; Height: 1.45mm; ManufacturerPartNumber: SN74LVC1G04DBVT; Arrow Part Number: SN74LVC1G04DBVT
U7 = CP2102N_QFN28: IC USB TO UART BRIDGE QFN28; ManufacturerPartNumber: CP2102N-A02-GQFN28R; Manufacturer: Silicon Labs
U8 = ADXL345BCCZ-RL: 3-Axis, ±2 g/±4 g/±8 g/±16 g Digital Accelerometer; Manufacturer: Analog Devices; Datasheet Link: https://www.analog.com/media/en/technical-documentation/data-sheets/ADXL345.pdf; Height: 1mm; ManufacturerPartNumber: ADXL345BCCZ-RL; Mouser Part Number: 584-ADXL345BCCZ-R; Mouser Price/Stock: https://www.mouser.co.uk/ProductDetail/Analog-Devices/ADXL345BCCZ-RL?qs=WIvQP4zGangSXrz9XHbgiA%3D%3D; Arrow Part Number: ADXL345BCCZ-RL; Arrow Price/Stock: https://www.arrow.com/en/products/adxl345bccz-rl/analog-devices?region=nac
Y1 = ABS07-32.768KHZ-T: 32.768kHz Â±20ppm Crystal 12.5pF 70 kOhms 2-SMD, No Lead; Manufacturer: Abracon LLC; Price: None; Value: *; Package: SMD-2 Abracon; Availability: Unavailable; SnapEDA_Link: https://www.snapeda.com/parts/ABS07-32.768KHZ/Abracon%20LLC/view-part/448682/?ref=snap; ManufacturerPartNumber: ABS07-32.768KHZ